# Altium schematic sheet 01-MCU_Core.SchDoc
size A3
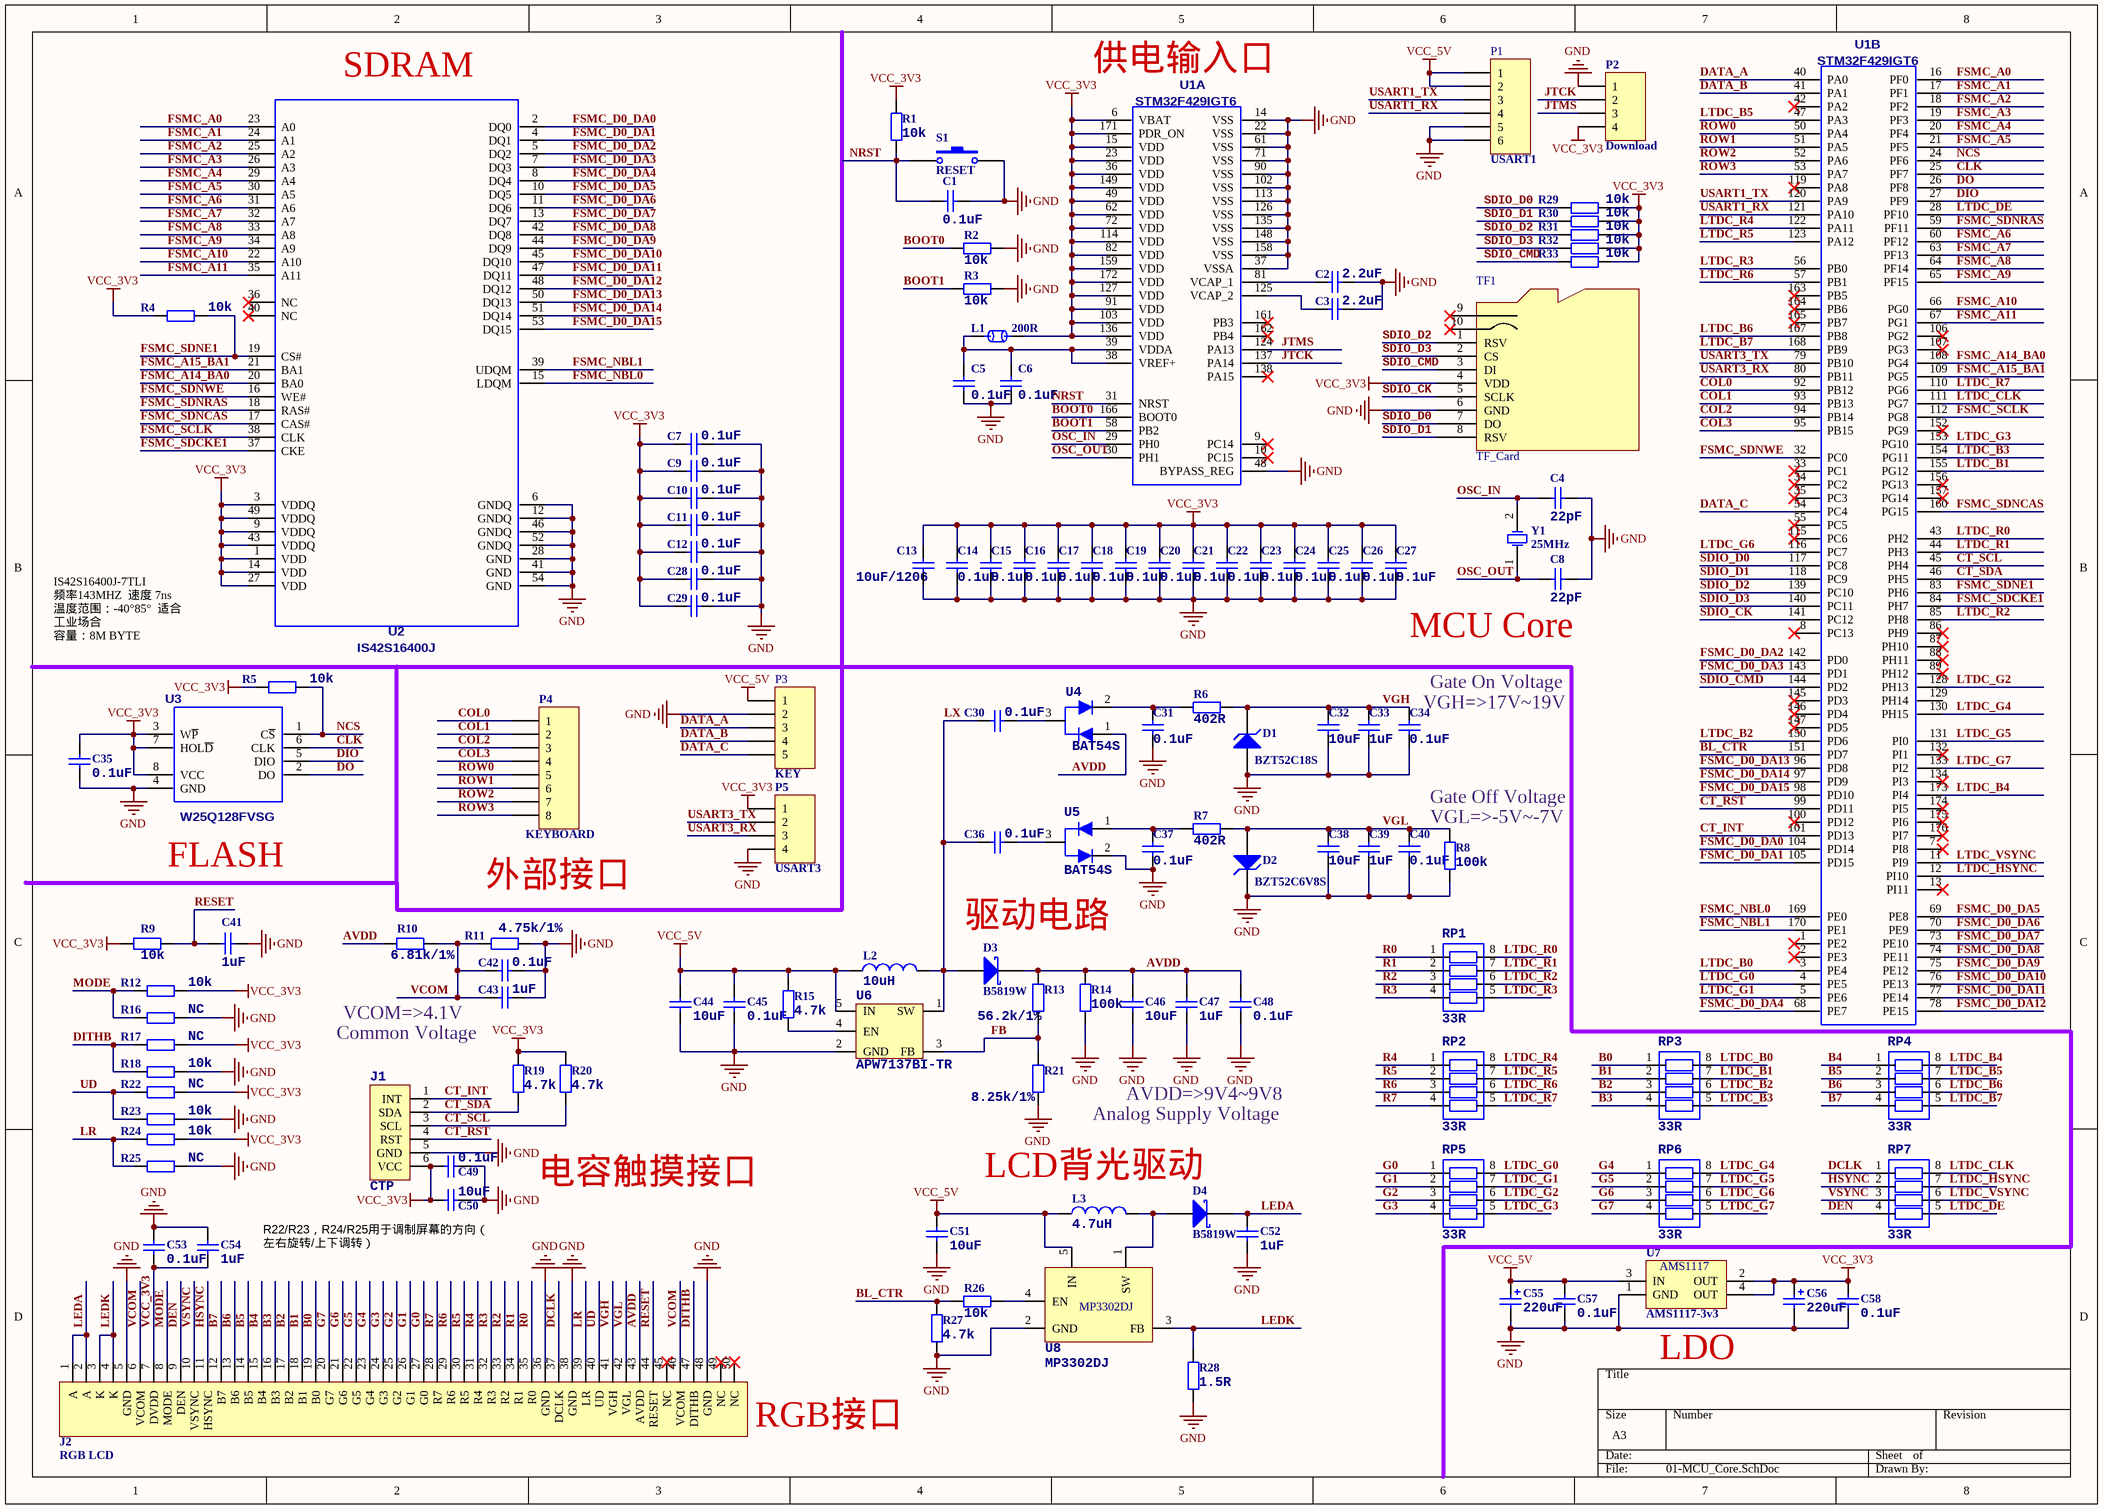
[diagram p0: 01-MCU_Core.SchDoc]

## Parts
C1  0.1uF  [C0603]
C2  2.2uF  [C0603]
C3  2.2uF  [C0603]
C4  22pF  [C0603]
C5  0.1uF  [C0603]
C6  0.1uF  [C0603]
C7  0.1uF  [C0603]
C8  22pF  [C0603]
C9  0.1uF  [C0603]
C10  0.1uF  [C0603]
C11  0.1uF  [C0603]
C12  0.1uF  [C0603]
C13  10uF/1206  [C1206]
C14  0.1uF  [C0603]
C15  0.1uF  [C0603]
C16  0.1uF  [C0603]
C17  0.1uF  [C0603]
C18  0.1uF  [C0603]
C19  0.1uF  [C0603]
C20  0.1uF  [C0603]
C21  0.1uF  [C0603]
C22  0.1uF  [C0603]
C23  0.1uF  [C0603]
C24  0.1uF  [C0603]
C25  0.1uF  [C0603]
C26  0.1uF  [C0603]
C27  0.1uF  [C0603]
C28  0.1uF  [C0603]
C29  0.1uF  [C0603]
C30  0.1uF  [C0603]
C31  0.1uF  [C0603]
C32  10uF  [C1206]
C33  1uF  [C0603]
C34  0.1uF  [C0603]
C35  0.1uF  [C0603]
C36  0.1uF  [C0603]
C37  0.1uF  [C0603]
C38  10uF  [C1206]
C39  1uF  [C0603]
C40  0.1uF  [C0603]
C41  1uF  [C0603]
C42  0.1uF  [C0603]
C43  1uF  [C0603]
C44  10uF  [C1206]
C45  0.1uF  [C0603]
C46  10uF  [C1206]
C47  1uF  [C0603]
C48  0.1uF  [C0603]
C49  0.1uF  [C0603]
C50  10uF  [C1206]
C51  10uF  [C1206]
C52  1uF  [C0603]
C53  0.1uF  [C0603]
C54  1uF  [C0603]
C55  220uF  [C_SMD(6.3x5.3)]
C56  220uF  [C_SMD(6.3x5.3)]
C57  0.1uF  [C0603]
C58  0.1uF  [C0603]
D1  BZT52C18S  [SOD323]
D2  BZT52C6V8S  [SOD323]
D3  B5819W  [SOD123]
D4  B5819W  [SOD123]
J1  CTP  [CTOUCH_6_TOP]
J2  RGB LCD  [FPC-TOP50]
L1  200R  [L0603]
L2  10uH  [ind2sm-4x4x3]
L3  4.7uH  [ind2sm-4x4x3]
P1  USART1  [XH2.54-6P]
P2  Download  [1.25PWT-4P]
P3  KEY  [XH2.54-5P]
P4  KEYBOARD  [XH2.54-8P]
P5  USART3  [XH2.54-4P]
R1  10k  [R0603]
R2  10k  [R0603]
R3  10k  [R0603]
R4  10k  [R0603]
R5  10k  [R0603]
R6  402R  [R0603]
R7  402R  [R0603]
R8  100k  [R0603]
R9  10k  [R0603]
R10  6.81k/1%  [R0603]
R11  4.75k/1%  [R0603]
R12  10k  [R0603]
R13  56.2k/1%  [R0603]
R14  100k  [R0603]
R15  4.7k  [R0603]
R16  NC  [R0603]
R17  NC  [R0603]
R18  10k  [R0603]
R19  4.7k  [R0603]
R20  4.7k  [R0603]
R21  8.25k/1%  [R0603]
R22  NC  [R0603]
R23  10k  [R0603]
R24  10k  [R0603]
R25  NC  [R0603]
R26  10k  [R0603]
R27  4.7k  [R0603]
R28  1.5R  [R0603]
R29  10k  [R0603]
R30  10k  [R0603]
R31  10k  [R0603]
R32  10k  [R0603]
R33  10k  [R0603]
RP1  33R  [RA0603]
RP2  33R  [RA0603]
RP3  33R  [RA0603]
RP4  33R  [RA0603]
RP5  33R  [RA0603]
RP6  33R  [RA0603]
RP7  33R  [RA0603]
S1  RESET  [micro button_2_SMD]
TF1  TF_Card  [SD Card]
U1  STM32F429IGT6  [LQFP176]  (parts A,B of 2)
U2  IS42S16400J  [TSOP-54]
U3  W25Q128FVSG  [SOP8-208]
U4  BAT54S  [SOT_23_3]
U5  BAT54S  [SOT_23_3]
U6  APW7137BI-TR  [SOT23-5]
U7  AMS1117-3v3  [SOT223]
U8  MP3302DJ  [SOT23-5]
Y1  25MHz  [HC-49SMD]

## Nets
GND: C1.2 C2.1 C3.1 C4.2 C5.1 C6.1 C7.1 C8.2 C9.1 C10.1 C11.1 C12.1 C13.2 C14.2 C15.2 C16.2 C17.2 C18.2 C19.2 C20.2 C21.2 C22.2 C23.2 C24.2 C25.2 C26.2 C27.2 C28.1 C29.1 C31.2 C32.2 C33.2 C34.2 C35.1 C37.2 C38.2 C39.2 C40.2 C41.1 C42.1 C43.1 C44.1 C45.1 C46.1 C47.1 C48.1 C49.1 C50.1 C51.1 C52.1 C53.2 C54.2 C55.2(-) C56.2(-) C57.1 C58.1 D1.1(A) D2.2(K) J1.5(GND) J2.5(GND) J2.36(GND) J2.38(GND) J2.48(GND) P1.5 P1.6 P2.1 P3.2 P5.4 R2.2 R3.2 R8.1 R11.2 R14.1 R16.2 R18.2 R21.1 R23.2 R25.2 R27.1 R28.1 S1.2 TF1.6(GND) U1.14(VSS) U1.22(VSS) U1.37(VSSA) U1.48(BYPASS_REG) U1.61(VSS) U1.71(VSS) U1.90(VSS) U1.102(VSS) U1.113(VSS) U1.126(VSS) U1.135(VSS) U1.148(VSS) U1.158(VSS) U2.6(GNDQ) U2.12(GNDQ) U2.28(GND) U2.41(GND) U2.46(GNDQ) U2.52(GNDQ) U2.54(GND) U3.4(GND) U5.2 U6.2(GND) U7.1(GND) U8.2(GND)
VCC_3V3: C7.2 C9.2 C10.2 C11.2 C12.2 C13.1 C14.1 C15.1 C16.1 C17.1 C18.1 C19.1 C20.1 C21.1 C22.1 C23.1 C24.1 C25.1 C26.1 C27.1 C28.2 C29.2 C35.2 C49.2 C50.2 C53.1 C54.1 C56.1(+) C58.2 J1.6(VCC) J2.7(DVDD) L1.2 P2.4 P5.1 R1.2 R4.1 R5.1 R9.1 R12.2 R17.2 R19.2 R20.2 R22.2 R24.2 R29.2 R30.2 R31.2 R32.2 R33.2 TF1.4(VDD) U1.6(VBAT) U1.15(VDD) U1.23(VDD) U1.36(VDD) U1.49(VDD) U1.62(VDD) U1.72(VDD) U1.82(VDD) U1.91(VDD) U1.103(VDD) U1.114(VDD) U1.127(VDD) U1.136(VDD) U1.149(VDD) U1.159(VDD) U1.171(PDR_ON) U1.172(VDD) U2.1(VDD) U2.3(VDDQ) U2.9(VDDQ) U2.14(VDD) U2.27(VDD) U2.43(VDDQ) U2.49(VDDQ) U3.3(W~{P}) U3.7(HOL~{D}) U3.8(VCC) U7.2(OUT) U7.4(OUT)
VCC_5V: C44.2 C45.2 C51.2 C55.1(+) C57.2 L2.1 L3.1 P1.1 P1.2 P3.1 R15.2 U6.5(IN) U7.3(IN) U8.5(IN)
AVDD: C46.2 C47.2 C48.2 D3.2(K) J2.43(AVDD) R10.1 R13.2 R14.2 U4.1
B0: J2.19(B0) RP3.1
B1: J2.18(B1) RP3.2
B2: J2.17(B2) RP3.3
B3: J2.16(B3) RP3.4
B4: J2.15(B4) RP4.1
B5: J2.14(B5) RP4.2
B6: J2.13(B6) RP4.3
B7: J2.12(B7) RP4.4
BL_CTR: R26.2 R27.2 U1.151(PD7)
BOOT0: R2.1 U1.166(BOOT0)
BOOT1: R3.1 U1.58(PB2)
CLK: U1.25(PF7) U3.6(CLK)
COL0: P4.1 U1.92(PB12)
COL1: P4.2 U1.93(PB13)
COL2: P4.3 U1.94(PB14)
COL3: P4.4 U1.95(PB15)
CT_INT: J1.1(INT) U1.101(PD13)
CT_RST: J1.4(RST) U1.99(PD11)
CT_SCL: J1.3(SCL) R20.1 U1.45(PH4)
CT_SDA: J1.2(SDA) R19.1 U1.46(PH5)
DATA_A: P3.3 U1.40(PA0)
DATA_B: P3.4 U1.41(PA1)
DATA_C: P3.5 U1.54(PC4)
DCLK: J2.37(DCLK) RP7.1
DEN: J2.9(DEN) RP7.4
DIO: U1.27(PF9) U3.5(DIO)
DITHB: J2.47(DITHB) R17.1 R18.1
DO: U1.26(PF8) U3.2(DO)
FB: R13.1 R21.2 U6.3(FB)
FSMC_A0: U1.16(PF0) U2.23(A0)
FSMC_A1: U1.17(PF1) U2.24(A1)
FSMC_A2: U1.18(PF2) U2.25(A2)
FSMC_A3: U1.19(PF3) U2.26(A3)
FSMC_A4: U1.20(PF4) U2.29(A4)
FSMC_A5: U1.21(PF5) U2.30(A5)
FSMC_A6: U1.60(PF12) U2.31(A6)
FSMC_A7: U1.63(PF13) U2.32(A7)
FSMC_A8: U1.64(PF14) U2.33(A8)
FSMC_A9: U1.65(PF15) U2.34(A9)
FSMC_A10: U1.66(PG0) U2.22(A10)
FSMC_A11: U1.67(PG1) U2.35(A11)
FSMC_A14_BA0: U1.108(PG4) U2.20(BA0)
FSMC_A15_BA1: U1.109(PG5) U2.21(BA1)
FSMC_D0_DA0: U1.104(PD14) U2.2(DQ0)
FSMC_D0_DA1: U1.105(PD15) U2.4(DQ1)
FSMC_D0_DA2: U1.142(PD0) U2.5(DQ2)
FSMC_D0_DA3: U1.143(PD1) U2.7(DQ3)
FSMC_D0_DA4: U1.68(PE7) U2.8(DQ4)
FSMC_D0_DA5: U1.69(PE8) U2.10(DQ5)
FSMC_D0_DA6: U1.70(PE9) U2.11(DQ6)
FSMC_D0_DA7: U1.73(PE10) U2.13(DQ7)
FSMC_D0_DA8: U1.74(PE11) U2.42(DQ8)
FSMC_D0_DA9: U1.75(PE12) U2.44(DQ9)
FSMC_D0_DA10: U1.76(PE13) U2.45(DQ10)
FSMC_D0_DA11: U1.77(PE14) U2.47(DQ11)
FSMC_D0_DA12: U1.78(PE15) U2.48(DQ12)
FSMC_D0_DA13: U1.96(PD8) U2.50(DQ13)
FSMC_D0_DA14: U1.97(PD9) U2.51(DQ14)
FSMC_D0_DA15: U1.98(PD10) U2.53(DQ15)
FSMC_NBL0: U1.169(PE0) U2.15(LDQM)
FSMC_NBL1: U1.170(PE1) U2.39(UDQM)
FSMC_SCLK: U1.112(PG8) U2.38(CLK)
FSMC_SDCKE1: U1.84(PH7) U2.37(CKE)
FSMC_SDNCAS: U1.160(PG15) U2.17(CAS#)
FSMC_SDNE1: R4.2 U1.83(PH6) U2.19(CS#)
FSMC_SDNRAS: U1.59(PF11) U2.18(RAS#)
FSMC_SDNWE: U1.32(PC0) U2.16(WE#)
G0: J2.27(G0) RP5.1
G1: J2.26(G1) RP5.2
G2: J2.25(G2) RP5.3
G3: J2.24(G3) RP5.4
G4: J2.23(G4) RP6.1
G5: J2.22(G5) RP6.2
G6: J2.21(G6) RP6.3
G7: J2.20(G7) RP6.4
HSYNC: J2.11(HSYNC) RP7.2
JTCK: P2.2 U1.137(PA14)
JTMS: P2.3 U1.124(PA13)
LEDA: C52.2 D4.2(K) J2.1(A) J2.2(A)
LEDK: J2.3(K) J2.4(K) R28.2 U8.3(FB)
LR: J2.39(LR) R24.1 R25.1
LTDC_B0: RP3.8 U1.3(PE4)
LTDC_B1: RP3.7 U1.155(PG12)
LTDC_B2: RP3.6 U1.150(PD6)
LTDC_B3: RP3.5 U1.154(PG11)
LTDC_B4: RP4.8 U1.173(PI4)
LTDC_B5: RP4.7 U1.47(PA3)
LTDC_B6: RP4.6 U1.167(PB8)
LTDC_B7: RP4.5 U1.168(PB9)
LTDC_CLK: RP7.8 U1.111(PG7)
LTDC_DE: RP7.5 U1.28(PF10)
LTDC_G0: RP5.8 U1.4(PE5)
LTDC_G1: RP5.7 U1.5(PE6)
LTDC_G2: RP5.6 U1.128(PH13)
LTDC_G3: RP5.5 U1.153(PG10)
LTDC_G4: RP6.8 U1.130(PH15)
LTDC_G5: RP6.7 U1.131(PI0)
LTDC_G6: RP6.6 U1.116(PC7)
LTDC_G7: RP6.5 U1.133(PI2)
LTDC_HSYNC: RP7.7 U1.12(PI10)
LTDC_R0: RP1.8 U1.43(PH2)
LTDC_R1: RP1.7 U1.44(PH3)
LTDC_R2: RP1.6 U1.85(PH8)
LTDC_R3: RP1.5 U1.56(PB0)
LTDC_R4: RP2.8 U1.122(PA11)
LTDC_R5: RP2.7 U1.123(PA12)
LTDC_R6: RP2.6 U1.57(PB1)
LTDC_R7: RP2.5 U1.110(PG6)
LTDC_VSYNC: RP7.6 U1.11(PI9)
LX: C30.2 C36.2 D3.1(A) L2.2 U6.1(SW)
MODE: J2.8(MODE) R12.1 R16.1
NCS: R5.2 U1.24(PF6) U3.1(C~{S})
NRST: C1.1 R1.1 S1.1 U1.31(NRST)
OSC_IN: C4.1 U1.29(PH0) Y1.2(OSC2)
OSC_OUT: C8.1 U1.30(PH1) Y1.1(OSC1)
R0: J2.35(R0) RP1.1
R1: J2.34(R1) RP1.2
R2: J2.33(R2) RP1.3
R3: J2.32(R3) RP1.4
R4: J2.31(R4) RP2.1
R5: J2.30(R5) RP2.2
R6: J2.29(R6) RP2.3
R7: J2.28(R7) RP2.4
RESET: C41.2 J2.44(RESET) R9.2
ROW0: P4.5 U1.50(PA4)
ROW1: P4.6 U1.51(PA5)
ROW2: P4.7 U1.52(PA6)
ROW3: P4.8 U1.53(PA7)
SDIO_CK: TF1.5(SCLK) U1.141(PC12)
SDIO_CMD: R33.1 TF1.3(DI) U1.144(PD2)
SDIO_D0: R29.1 TF1.7(DO) U1.117(PC8)
SDIO_D1: R30.1 TF1.8(RSV) U1.118(PC9)
SDIO_D2: R31.1 TF1.1(RSV) U1.139(PC10)
SDIO_D3: R32.1 TF1.2(CS) U1.140(PC11)
UD: J2.40(UD) R22.1 R23.1
USART1_RX: P1.4 U1.121(PA10)
USART1_TX: P1.3 U1.120(PA9)
USART3_RX: P5.3 U1.80(PB11)
USART3_TX: P5.2 U1.79(PB10)
VCOM: C42.2 C43.2 J2.6(VCOM) J2.46(VCOM) R10.2 R11.1
VGH: C32.1 C33.1 C34.1 D1.2(K) J2.41(VGH) R6.2
VGL: C38.1 C39.1 C40.1 D2.1(A) J2.42(VGL) R7.2 R8.2
VSYNC: J2.10(VSYNC) RP7.3
NetC2_2: C2.2 U1.81(VCAP_1)
NetC3_2: C3.2 U1.125(VCAP_2)
NetC5_2: C5.2 C6.2 L1.1 U1.38(VREF+) U1.39(VDDA)
NetC30_1: C30.1 U4.3
NetC31_1: C31.1 R6.1 U4.2
NetC36_1: C36.1 U5.3
NetC37_1: C37.1 R7.1 U5.1
NetD4_1: D4.1(A) L3.2 U8.1(SW)
NetR15_1: R15.1 U6.4(EN)
NetR26_1: R26.1 U8.4(EN)

Not connected (* = marked no-connect by the designer): J2 45(NC)* 49(NC)* 50(NC)*; TF1 9* 10*; U1 1(PE2)* 2(PE3)* 7(PI8)* 8(PC13)* 9(PC14)* 10(PC15)* 13(PI11)* 33(PC1)* 34(PC2)* 35(PC3)* 42(PA2)* 55(PC5)* 86(PH9)* 87(PH10)* 88(PH11)* 89(PH12)* 100(PD12)* 106(PG2)* 107(PG3)* 115(PC6)* 119(PA8)* 129(PH14) 132(PI1)* 134(PI3)* 138(PA15)* 145(PD3)* 146(PD4)* 147(PD5)* 152(PG9)* 156(PG13)* 157(PG14)* 161(PB3)* 162(PB4)* 163(PB5)* 164(PB6)* 165(PB7)* 174(PI5)* 175(PI6)* 176(PI7)*; U2 36(NC)* 40(NC)*

## Notes on the sheet
- (near U2) SDRAM
- (near U1) 供电输入口
- IS42S16400J-7TLI
  频率143MHZ  速度 7ns
  温度范围：-40°85°  适合工业场合
  容量：8M BYTE
- MCU Core
- (near C34) VGH=>17V~19V
- (near C34) Gate On Voltage
- (near R8) VGL=>-5V~-7V
- Gate Off Voltage
- FLASH
- 外部接口
- 驱动电路
- Common Voltage
- VCOM=>4.1V
- Analog Supply Voltage
- AVDD=>9V4~9V8
- 电容触摸接口
- (near L3) LCD背光驱动
- (near C50) R22/R23，R24/R25用于调制屏幕的方向（左右旋转/上下调转）
- (near U7) LDO
- (near J2) RGB接口
- (in symbol AMS1117-3v3) AMS1117

## Library data of the parts
C1-C54 C57 C58 = Cap1: CAP CER 10000PF 100V X7R 0603; Manufacturer: TDK Corporation; Manufacturer Part Number: C1608X7R2A103K080AA; Tolerance: ±10%; Notification: Current market demand for these product types have resulted in fluctuating and extending lead times. Lead times may differ.; Supplier 1: Digi-Key; RoHS: RoHS Compliant; Category: Capacitors; Stock 1: 40000; Pricing 1: 4000=0.01438 (USD); Packaging: Tape & Reel (TR); Part Status: Active; Voltage - Rated: 100V; Temperature Coefficient: X7R; Operating Temperature: -55°C ~ 125°C; Features: -; Ratings: -; Applications: General Purpose; Failure Rate: -; Mounting Type: Surface Mount, MLCC; Package / Case: 0603 (1608 Metric); Size / Dimension: 0.063" L x 0.032" W (1.60mm x 0.80mm); Height - Seated (Max): -; Thickness (Max): 0.035" (0.90mm); Lead Spacing: -; Lead Style: -; ComponentLink1URL: https://product.tdk.com/info/en/catalog/datasheets/mlcc_commercial_midvoltage_en.pdf; ComponentLink1Description: https://product.tdk.com/info/en/catalog/datasheets/mlcc_commercial_midvoltage_en.pdf; Supplier Part Number 1: 445-1304-2-ND
  C1 C5-C7 C9-C12 C14-C31 C34-C37 C40 C42 C45 C48 C49 C53 C57 C58: Value: 0.1uF
  C2 C3: Value: 2.2uF
  C4 C8: Value: 22pF
  C13: Value: 10uF/1206
  C32 C38 C44 C46 C50 C51: Value: 10uF
  C33 C39 C41 C43 C47 C52 C54: Value: 1uF
C55 C56 = Cap2: CAP TANT 10UF 10V 10% 1206; Manufacturer: KEMET; Manufacturer Part Number: T491A106K010AT7280; Manufacturer Size Code: A; Type: Molded; ESR (Equivalent Series Resistance): 3.8 Ohm; Lifetime @ Temp.: 2000 Hrs @ 125°C; Notification: Current market demand for these product types have resulted in fluctuating and extending lead times. Lead times may differ.; Supplier 1: Digi-Key; RoHS: RoHS Compliant; Category: Capacitors; Stock 1: 27000; Pricing 1: 9000=0.084, 18000=0.08138, 27000=0.07875, 63000=0.0735 (USD); Packaging: Tape & Reel (TR); Part Status: Active; Tolerance: ±10%; Operating Temperature: -55°C ~ 125°C; Mounting Type: Surface Mount; Package / Case: 1206 (3216 Metric); Size / Dimension: 0.126" L x 0.063" W (3.20mm x 1.60mm); Height - Seated (Max): 0.071" (1.80mm); Lead Spacing: -; Features: General Purpose; Failure Rate: -; ComponentLink1URL: https://api.kemet.com/component-edge/download/datasheet/T491A106K010AT7280.pdf; ComponentLink1Description: https://api.kemet.com/component-edge/download/datasheet/T491A106K010AT7280.pdf; Supplier Part Number 1: 399-8268-2-ND; Value: 220uF
D1 D2 = D Zener: Zener Diode; Published: 8-Jun-2000; LatestRevisionDate: 17-Jul-2002; LatestRevisionNote: Re-released for DXP Platform.; PackageReference: DIODE-0.7; Publisher: Altium Limited; PackageDescription: Diode, Thru-Hole; 2 Leads; 0.7 in Pin Spacing
D3 D4 = D Schottky: Schottky Diode; Published: 8-Jun-2000; LatestRevisionDate: 17-Jul-2002; LatestRevisionNote: Re-released for DXP Platform.; PackageReference: SMB; Publisher: Altium Limited; PackageDescription: DO-214-AA/SMB; 2 C-Bend Leads; Body 5.3 x 3.6 mm, inc. leads (LxW); Code_JEDEC: DO-214-AA
J2 = LCD_RGB_7R
L1 = FBMH1608HM102-T: FERRITE BEAD 1 KOHM 0603 1LN; Manufacturer: Taiyo Yuden; Filter Type: Power Line; Current Rating (Max): 600mA; DC Resistance (DCR) (Max): 350 mOhm; Supplier 1: Digi-Key; Manufacturer Part Number: FBMH1608HM102-T; RoHS: RoHS Compliant; Category: Filters; Stock 1: 620000; Pricing 1: 4000=0.0224, 8000=0.0203, 12000=0.0196, 28000=0.0182, 100000=0.01799 (USD); Packaging: Tape & Reel (TR); Part Status: Active; Ratings: -; Operating Temperature: -40°C ~ 125°C; Package / Case: 0603 (1608 Metric); Mounting Type: Surface Mount; Height (Max): 0.035" (0.90mm); Size / Dimension: 0.063" L x 0.032" W (1.60mm x 0.80mm); ComponentLink1URL: http://ds.yuden.co.jp/TYCOMPAS/ut/detail.do?productNo=FBMH1608HM102-T&fileName=FBMH1608HM102-T_SS&mode=specSheetDownload; ComponentLink1Description: http://ds.yuden.co.jp/TYCOMPAS/ut/detail.do?productNo=FBMH1608HM102-T&fileName=FBMH1608HM102-T_SS&mode=specSheetDownload; Supplier Part Number 1: 587-1739-2-ND; Value: 200R
L2 L3 = Inductors: FIXED IND 240NH 4.4A 22MOHM SMD; Manufacturer: Samsung Electro-Mechanics; Manufacturer Part Number: CIGT201210UHR24MNE; Type: Thin Film; Material - Core: Metal Composite; Tolerance: ±20%; Current - Saturation: 6.6A; Shielding: Unshielded; DC Resistance (DCR): 22 mOhm Max; Supplier 1: Digi-Key; RoHS: RoHS Compliant; Category: Inductors, Coils, Chokes; Stock 1: 17555; Pricing 1: 1=0.26, 10=0.23, 100=0.1579, 500=0.13492, 1000=0.10334 (USD); Packaging: Cut Tape (CT); Part Status: Active; Q @ Freq: -; Frequency - Self Resonant: -; Ratings: -; Operating Temperature: -40°C ~ 125°C; Features: -; Mounting Type: Surface Mount; Package / Case: 0805 (2012 Metric); Supplier Device Package: 0603 (1608 Metric); Size / Dimension: 0.079" L x 0.049" W (2.00mm x 1.25mm); Height - Seated (Max): 0.039" (1.00mm); ComponentLink1URL: http://www.samsungsem.com/kr/support/product-search/inductor/CIGT201210UHR24MNE.jsp; ComponentLink1Description: http://www.samsungsem.com/kr/support/product-search/inductor/CIGT201210UHR24MNE.jsp; Supplier Part Number 1: 1276-6890-1-ND
  L2: Value: 10uH
  L3: Value: 4.7uH
P1 = Header 6: Header, 6-Pin; LatestRevisionDate: 17-Jul-2002; LatestRevisionNote: Re-released for DXP Platform.; Publisher: Altium Limited
P2 P5 = Header 4: Header, 4-Pin; LatestRevisionDate: 17-Jul-2002; LatestRevisionNote: Re-released for DXP Platform.; Publisher: Altium Limited
P3 = Header 5: Header, 5-Pin; LatestRevisionDate: 17-Jul-2002; LatestRevisionNote: Re-released for DXP Platform.; Publisher: Altium Limited
P4 = Header 8: Header, 8-Pin; LatestRevisionDate: 17-Jul-2002; LatestRevisionNote: Re-released for DXP Platform.; Publisher: Altium Limited
R1-R33 = Res2: RES SMD 5.1K OHM 5% 1/10W 0603; Manufacturer: Bourns Inc.; Manufacturer Part Number: CR0603-JW-512ELF; Power (Watts): 0.1W, 1/10W; Temperature Coefficient: ±200ppm/°C; Supplier 1: Digi-Key; RoHS: RoHS Compliant; Category: Resistors; Stock 1: 30000; Pricing 1: 5000=0.00188, 10000=0.00163, 25000=0.00144, 50000=0.00132, 125000=0.00131 (USD); Packaging: Tape & Reel (TR); Part Status: Active; Tolerance: ±5%; Composition: Thick Film; Features: Moisture Resistant; Operating Temperature: -55°C ~ 155°C; Package / Case: 0603 (1608 Metric); Supplier Device Package: 0603; Size / Dimension: 0.063" L x 0.032" W (1.60mm x 0.80mm); Height - Seated (Max): 0.022" (0.55mm); Failure Rate: -; ComponentLink1URL: https://www.bourns.com/docs/Product-Datasheets/CHPREZTR.pdf; ComponentLink1Description: https://www.bourns.com/docs/Product-Datasheets/CHPREZTR.pdf; Supplier Part Number 1: CR0603-JW-512ELFTR-ND
  R1-R5 R9 R12 R18 R23 R24 R26 R29-R33: Value: 10k
  R6 R7: Value: 402R
  R8 R14: Value: 100k
  R10: Value: 6.81k/1%
  R11: Value: 4.75k/1%
  R13: Value: 56.2k/1%
  R15 R19 R20 R27: Value: 4.7k
  R16 R17 R22 R25: Value: NC
  R21: Value: 8.25k/1%
  R28: Value: 1.5R
RP1-RP7 = RPX4: VALUE: 33R
S1 = SW-PB: Switch; Published: 24-Mar-1999; LatestRevisionDate: 17-Jul-2002; LatestRevisionNote: Re-released for DXP Platform.; PackageReference: SPST-2; Publisher: Altium Limited; PackageDescription: Switch; 2 Leads
TF1 = TF_CADE_1
U1 = STM32F767IGT6: PCB DECAL: LQFP176; Value: STM32F767IGT6
Y1 = XTAL: Crystal Oscillator; Published: 8-Jun-2000; LatestRevisionDate: 17-Jul-2002; LatestRevisionNote: Re-released for DXP Platform.; PackageReference: R38; Publisher: Altium Limited; PackageDescription: Crystal, Thru-Hole; 2 Leads; Body 3.1 x 8.2 mm (Dia.xH)
U2 = IS42S16400J: PCB DECAL: TSOP-54; Value: IS42S16400J
U3 = W25Q128FVSG: PCB DECAL: W25Q128; value: W25Q128FVSG